# EAGLE design qfn-20-4mm-0.5mm-socket-pcb-mk-1.0.0 (EAGLE 9.2.2)
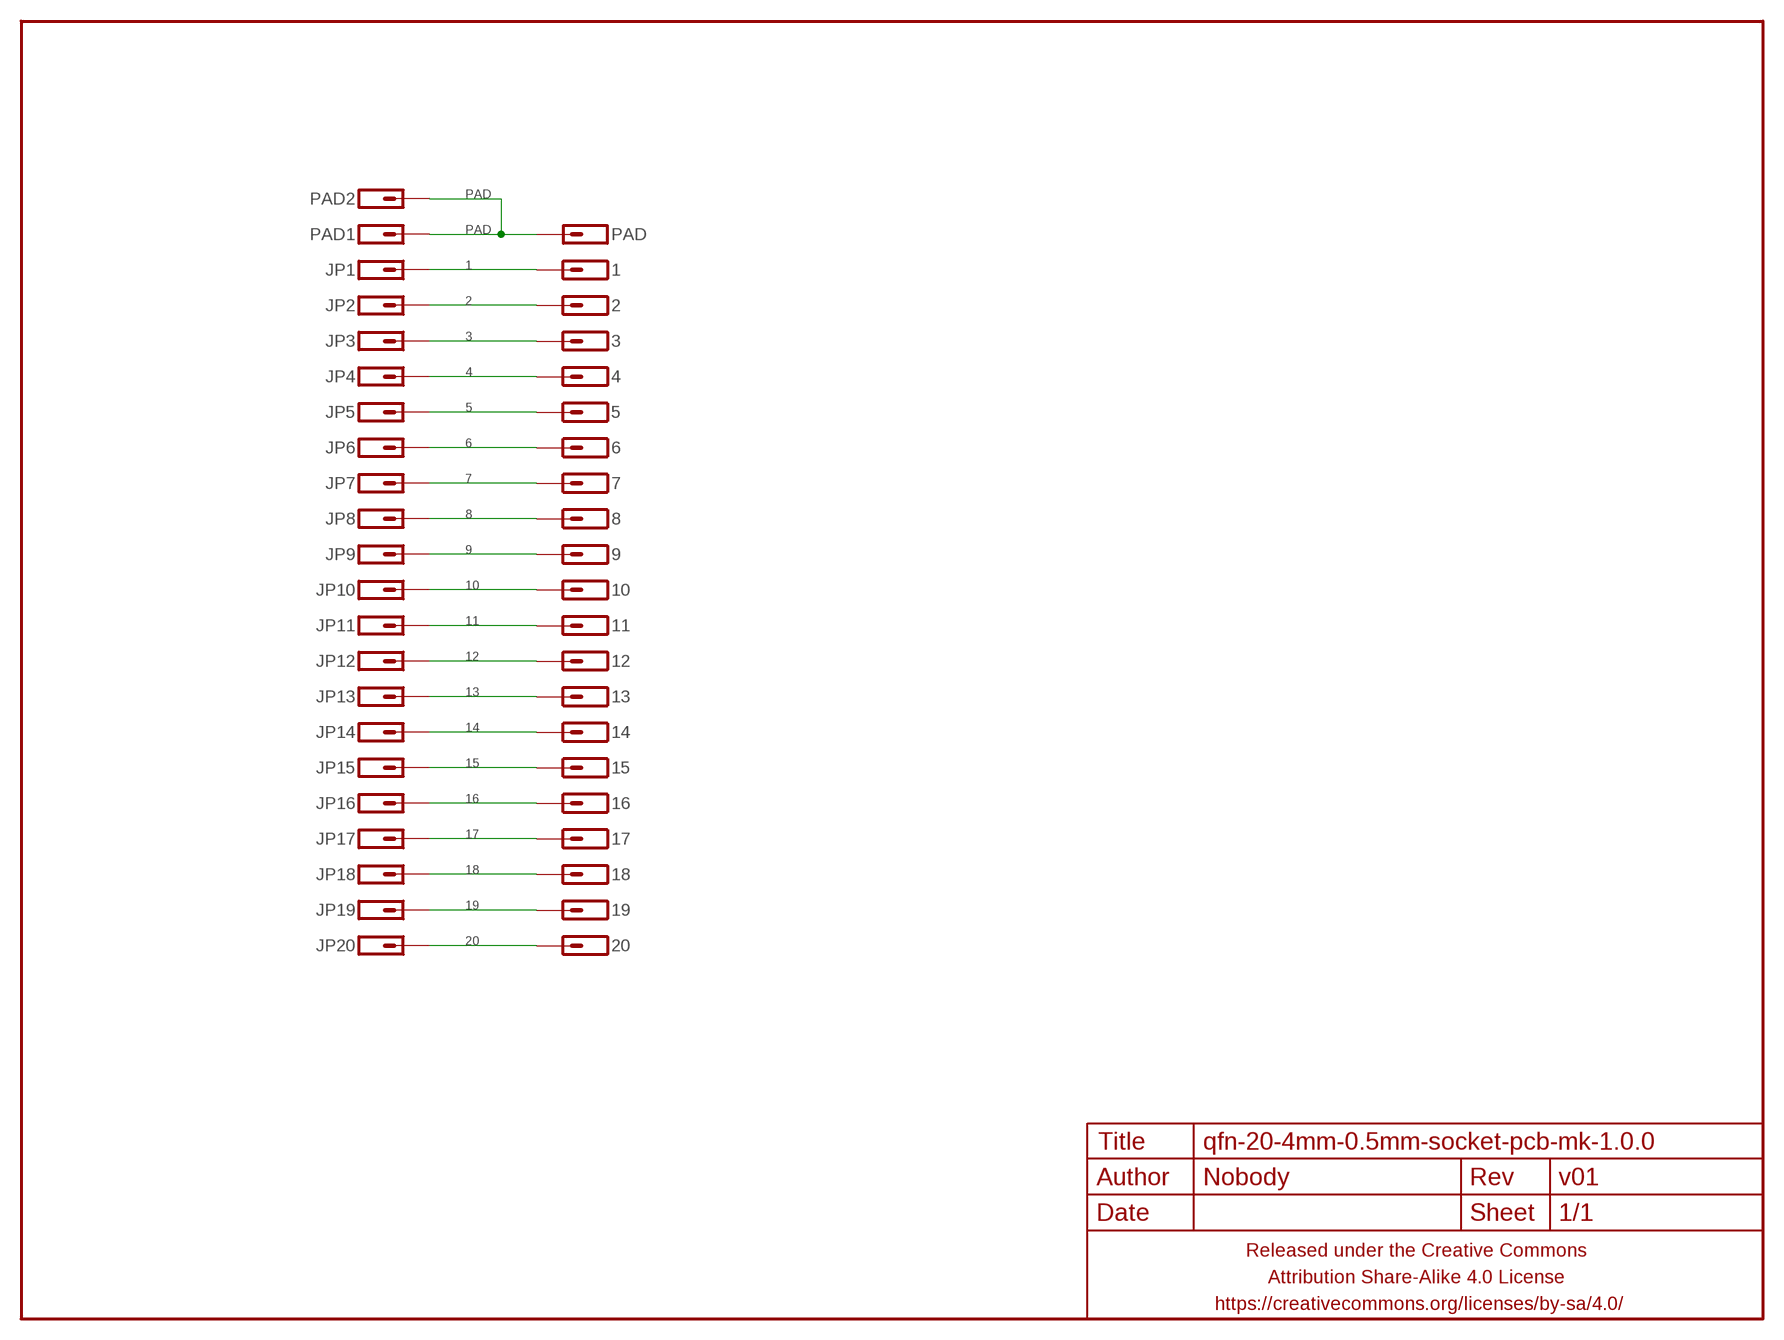
[diagram p0: schematic, sheet 1]

## Parts
1  M01PTH  [1X01]
2  M01PTH  [1X01]
3  M01PTH  [1X01]
4  M01PTH  [1X01]
5  M01PTH  [1X01]
6  M01PTH  [1X01]
7  M01PTH  [1X01]
8  M01PTH  [1X01]
9  M01PTH  [1X01]
10  M01PTH  [1X01]
11  M01PTH  [1X01]
12  M01PTH  [1X01]
13  M01PTH  [1X01]
14  M01PTH  [1X01]
15  M01PTH  [1X01]
16  M01PTH  [1X01]
17  M01PTH  [1X01]
18  M01PTH  [1X01]
19  M01PTH  [1X01]
20  M01PTH  [1X01]
FRAME1  FRAME-LETTERNO_PACKAGE  [DUMMY]
JP1  M01PTH-0.4MM  [1X01-0.4MM]
JP2  M01PTH-0.4MM  [1X01-0.4MM]
JP3  M01PTH-0.4MM  [1X01-0.4MM]
JP4  M01PTH-0.4MM  [1X01-0.4MM]
JP5  M01PTH-0.4MM  [1X01-0.4MM]
JP6  M01PTH-0.4MM  [1X01-0.4MM]
JP7  M01PTH-0.4MM  [1X01-0.4MM]
JP8  M01PTH-0.4MM  [1X01-0.4MM]
JP9  M01PTH-0.4MM  [1X01-0.4MM]
JP10  M01PTH-0.4MM  [1X01-0.4MM]
JP11  M01PTH-0.4MM  [1X01-0.4MM]
JP12  M01PTH-0.4MM  [1X01-0.4MM]
JP13  M01PTH-0.4MM  [1X01-0.4MM]
JP14  M01PTH-0.4MM  [1X01-0.4MM]
JP15  M01PTH-0.4MM  [1X01-0.4MM]
JP16  M01PTH-0.4MM  [1X01-0.4MM]
JP17  M01PTH-0.4MM  [1X01-0.4MM]
JP18  M01PTH-0.4MM  [1X01-0.4MM]
JP19  M01PTH-0.4MM  [1X01-0.4MM]
JP20  M01PTH-0.4MM  [1X01-0.4MM]
PAD  M01PTH-1MM-CIR-NS  [1X01-1MM-CIR-NS]
PAD1  M01PTH  [1X01]
PAD2  M01PTH  [1X01]

## Nets
1: 1.1 JP1.P$1
2: 2.1 JP2.P$1
3: 3.1 JP3.P$1
4: 4.1 JP4.P$1
5: 5.1 JP5.P$1
6: 6.1 JP6.P$1
7: 7.1 JP7.P$1
8: 8.1 JP8.P$1
9: 9.1 JP9.P$1
10: 10.1 JP10.P$1
11: 11.1 JP11.P$1
12: 12.1 JP12.P$1
13: 13.1 JP13.P$1
14: 14.1 JP14.P$1
15: 15.1 JP15.P$1
16: 16.1 JP16.P$1
17: 17.1 JP17.P$1
18: 18.1 JP18.P$1
19: 19.1 JP19.P$1
20: 20.1 JP20.P$1
PAD: PAD1.1 PAD2.1 PAD.1

## Library data of the parts
1-20 JP1-JP20 PAD PAD1 PAD2 = a_parts:M01: Header 1 Standard 1-pin 0.1" header. Use with straight break away headers (SKU : PRT-00116), right angle break away headers (PRT-00553), swiss pins (PRT-00743), machine pins (PRT-00117), and female headers (PRT-00115).
FRAME1 = a_parts:FRAME-LETTER: Schematic Frame Standard 8.5x11 US Letter frame; DESIGNER: Nobody; VERSION: v01

## Board
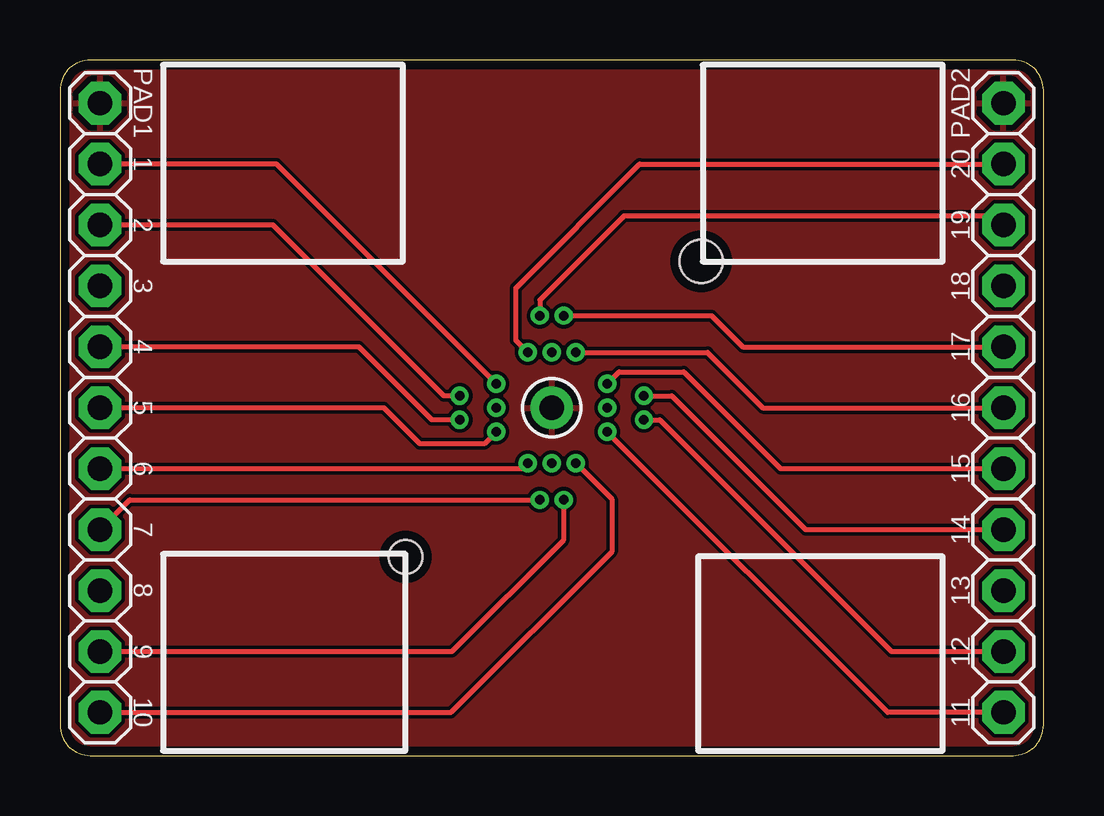
[diagram p1: board, top side]
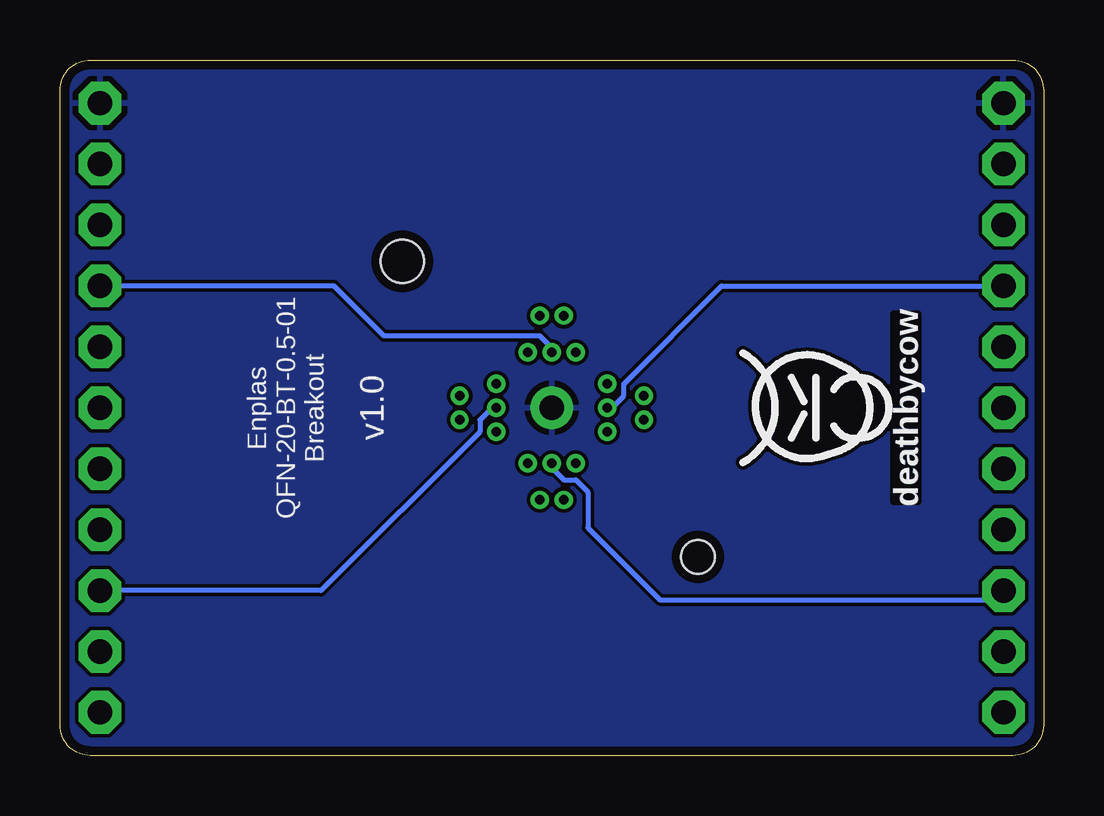
[diagram p2: board, bottom side, seen from below]

Size 41 x 29 mm. Coordinates in mm from the lower left corner, seen from the top.
Outline: 0,27.73 0,1.27 arc90 1.27,0 39.73,0 arc90 41,1.27 41,27.73 arc90 39.73,29 1.27,29 arc90 0,27.73
Copper layers (1*16): Top 0.0356mm / dielectric 1.5011mm / Bottom 0.0356mm
Design rules "LaenPCBOrder_2": minimum track width 6mil, minimum drill 13mil, track to track 6mil, track to pad 6mil, pad to pad 6mil, via to via 6mil, smd to smd 6mil, copper to edge 15mil, drill to drill 6mil, minimum pad ring 7mil, minimum via ring 7mil, stop-mask expansion 3mil, vias tented up to drill 20mil, thermal gap 10mil
Holes 1.8 mm at 26.73,20.6
Holes 1.4 mm at 14.4,8.28
vRestrict: area 4,20.6 to 14.3,29; area 26.7,20.6 to 37,29; area 4,0 to 14.4,8.4; area 26.6,0 to 37,8.4

### Footprints (pad centres in the part's own frame; a part is rotated, then mirrored left to right if it is on the bottom)
1X01 = drill 1.016 pad 1.778 octagon: 1 0,0
1X01-0.4MM = drill 0.4: P$1 0,0
1X01-1MM-CIR-NS = drill 1.016 pad 1.778: 1 0,0

### Placement (x,y rotation side)
1  1.67,24.66 270 top
2  1.67,22.12 270 top
3  1.67,19.58 270 top
4  1.67,17.04 270 top
5  1.67,14.5 270 top
6  1.67,11.96 270 top
7  1.67,9.42 270 top
8  1.67,6.88 270 top
9  1.67,4.34 270 top
10  1.67,1.8 270 top
11  39.33,1.8 90 top
12  39.33,4.34 90 top
13  39.33,6.88 90 top
14  39.33,9.42 90 top
15  39.33,11.96 90 top
16  39.33,14.5 90 top
17  39.33,17.04 90 top
18  39.33,19.58 90 top
19  39.33,22.12 90 top
20  39.33,24.66 90 top
FRAME1  0,0 0 top
JP1  18.19,15.5 0 top
JP2  16.66,15 0 bottom
JP3  18.19,14.5 0 top
JP4  16.66,14 0 top
JP5  18.19,13.5 0 top
JP6  19.5,12.19 0 top
JP7  20,10.66 0 top
JP8  20.5,12.19 0 top
JP9  21,10.66 0 top
JP10  21.5,12.19 0 top
JP11  22.81,13.5 0 top
JP12  24.34,14 0 top
JP13  22.81,14.5 0 top
JP14  24.34,15 0 top
JP15  22.81,15.5 0 top
JP16  21.5,16.81 0 top
JP17  21,18.34 0 top
JP18  20.5,16.81 0 top
JP19  20,18.34 0 top
JP20  19.5,16.81 0 top
PAD  20.5,14.5 0 top
PAD1  1.67,27.2 270 top
PAD2  39.33,27.2 90 top
U$1  [COW_SMALL_METAL]  10,14.5 90 bottom

### Tracks (layer width: path | path; a pad name or v marks a point on that pad's centre or on a via)
1
  Top 0.2: JP1.P$1 9.03,24.66 1.1
2
  Top 0.2: JP2.P$1 16,15 8.88,22.12 2.1
3
  Bottom 0.2: JP3.P$1 18,14.5 17.5,15 17.5,15.5 13.42,19.58 3.1
4
  Top 0.2: JP4.P$1 15.5,14 12.46,17.04 4.1
5
  Top 0.2: JP5.P$1 17.69,13 15,13 13.5,14.5 5.1
6
  Top 0.2: 6.1 19.27,11.96 JP6.P$1
7
  Top 0.2: 7.1 2.91,10.66 JP7.P$1
8
  Bottom 0.2: JP8.P$1 20.5,12 20,11.5 19.5,11.5 19,11 19,9.5 16,6.5 2.05,6.5 8.1
9
  Top 0.2: 9.1 16.34,4.34 21,9 JP9.P$1
10
  Top 0.2: 10.1 16.3,1.8 23,8.5 23,10.69 JP10.P$1
11
  Top 0.2: 11.1 34.51,1.8 JP11.P$1
12
  Top 0.2: JP12.P$1 25,14 34.66,4.34 12.1
13
  Bottom 0.2: JP13.P$1 23,14.5 23.5,14 23.5,13.5 30.12,6.88 13.1
14
  Top 0.2: 14.1 31.08,9.42 25.5,15 JP14.P$1
15
  Top 0.2: JP15.P$1 23.31,16 26,16 30.04,11.96 15.1
16
  Top 0.2: JP16.P$1 26.99,16.81 29.3,14.5 16.1
17
  Top 0.2: JP17.P$1 27.16,18.34 28.46,17.04 17.1
18
  Bottom 0.2: JP18.P$1 20.5,17 21,17.5 27.5,17.5 29.58,19.58 18.1
19
  Top 0.2: 19.1 38.95,22.5 23.5,22.5 20,19 JP19.P$1
20
  Top 0.2: JP20.P$1 19,17.31 19,19.5 24.16,24.66 20.1
PAD
  pour Top: 0,0 41,0 41,29 0,29
  pour Bottom: 0,0 41,0 41,29 0,29

### Text on the board
bPlace: Enplas / QFN-20-BT-0.5-01 / Breakout